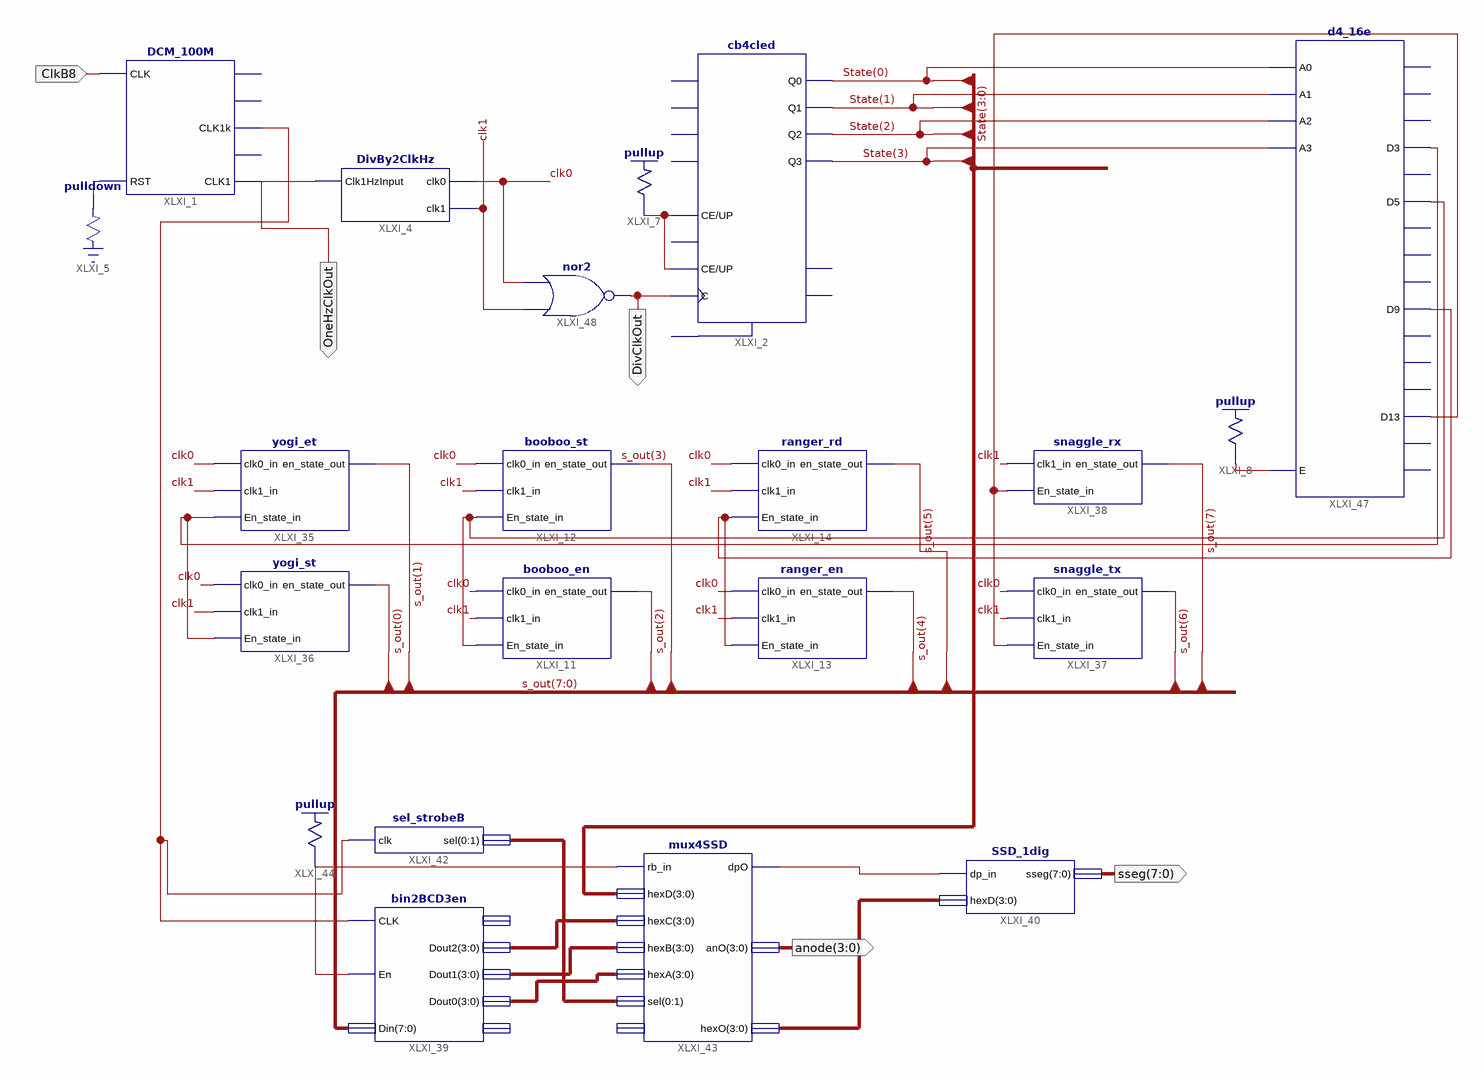
[diagram p0: schematic sheet 1]
// Xilinx ISE schematic SequenceGen.sch (spartan3e) as structural Verilog: 21 symbols, 5 ports
module SequenceGen (
  input  ClkB8,
  output OneHzClkOut,
  output DivClkOut,
  output [3:0] anode,
  output [7:0] sseg
);

  wire clk0, clk1, XLXN_2, XLXN_7, XLXN_72, XLXN_77, XLXN_81, XLXN_89, XLXN_94, XLXN_95, XLXN_96, XLXN_97;
  wire [1:0] XLXN_66;
  wire [3:0] State, XLXN_73, XLXN_74, XLXN_75, XLXN_76;
  wire [7:0] s_out;

  DCM_100M XLXI_1 (.CLK(ClkB8), .RST(XLXN_2), .CLK1k(XLXN_81), .CLK1(OneHzClkOut));  // open: CLK1M, CLK10k, CLK100
  cb4cled XLXI_2 (
    .C(DivClkOut), .CE(XLXN_7), .UP(XLXN_7), .Q0(State[0]), .Q1(State[1]), .Q2(State[2]), .Q3(State[3]));  // open: CLR, D0, D1, D2, D3, L, CEO, TC
  DivBy2ClkHz XLXI_4 (.Clk1HzInput(OneHzClkOut), .clk0(clk0), .clk1(clk1));
  \pulldown  XLXI_5 (.O(XLXN_2));
  \pullup  XLXI_7 (.O(XLXN_7));
  \pullup  XLXI_8 (.O(XLXN_89));
  booboo_en XLXI_11 (.clk0_in(clk0), .clk1_in(clk1), .En_state_in(XLXN_96), .en_state_out(s_out[2]));
  booboo_st XLXI_12 (.clk0_in(clk0), .clk1_in(clk1), .En_state_in(XLXN_96), .en_state_out(s_out[3]));
  ranger_en XLXI_13 (.clk0_in(clk0), .clk1_in(clk1), .En_state_in(XLXN_95), .en_state_out(s_out[4]));
  ranger_rd XLXI_14 (.clk0_in(clk0), .clk1_in(clk1), .En_state_in(XLXN_95), .en_state_out(s_out[5]));
  yogi_et XLXI_35 (.clk0_in(clk0), .clk1_in(clk1), .En_state_in(XLXN_97), .en_state_out(s_out[1]));
  yogi_st XLXI_36 (.clk0_in(clk0), .clk1_in(clk1), .En_state_in(XLXN_97), .en_state_out(s_out[0]));
  snaggle_tx XLXI_37 (.clk0_in(clk0), .clk1_in(clk1), .En_state_in(XLXN_94), .en_state_out(s_out[6]));
  snaggle_rx XLXI_38 (.clk1_in(clk1), .En_state_in(XLXN_94), .en_state_out(s_out[7]));
  bin2BCD3en XLXI_39 (
    .CLK(XLXN_81), .En(XLXN_72), .Din(s_out), .Dout2(XLXN_73), .Dout1(XLXN_74), .Dout0(XLXN_75));  // open: Dout3, RBout
  SSD_1dig XLXI_40 (.dp_in(XLXN_77), .hexD(XLXN_76), .sseg(sseg));
  sel_strobeB XLXI_42 (.clk(XLXN_81), .sel({XLXN_66[0], XLXN_66[1]}));
  mux4SSD XLXI_43 (
    .rb_in(XLXN_72), .hexD(State), .hexC(XLXN_73), .hexB(XLXN_74), .hexA(XLXN_75),
    .sel({XLXN_66[0], XLXN_66[1]}), .dpO(XLXN_77), .anO(anode), .hexO(XLXN_76));  // open: dp_in
  \pullup  XLXI_44 (.O(XLXN_72));
  d4_16e XLXI_47 (
    .A0(State[0]), .A1(State[1]), .A2(State[2]), .A3(State[3]), .E(XLXN_89), .D13(XLXN_94), .D3(XLXN_97),
    .D5(XLXN_96), .D9(XLXN_95));  // open: D0, D1, D10, D11, D12, D14, D15, D2, D4, D6, D7, D8
  nor XLXI_48 (DivClkOut, clk1, clk0);
endmodule
